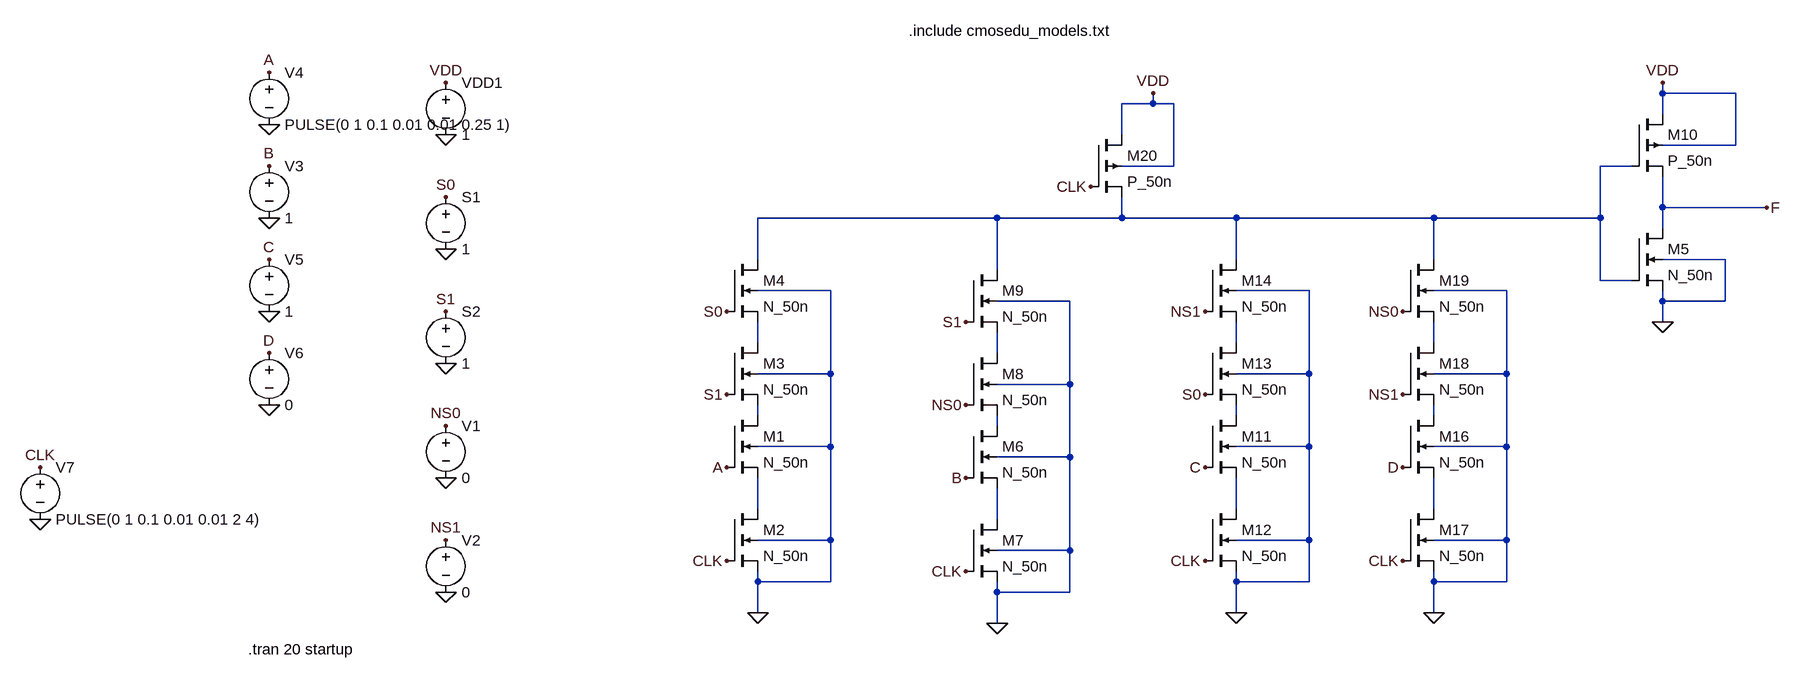
[diagram p0: schematic Draft2.asc]
Draft2.asc, the LTspice schematic file:
Version 4.1
SHEET 1 1412 984
WIRE 1136 112 1136 96
WIRE 1248 112 1136 112
WIRE 352 128 352 112
WIRE 352 128 304 128
WIRE 384 128 352 128
WIRE 1136 144 1136 112
WIRE 304 176 304 128
WIRE 1248 192 1248 112
WIRE 1248 192 1136 192
WIRE 384 224 384 128
WIRE 384 224 304 224
WIRE 1088 224 1040 224
WIRE 1136 288 1136 240
WIRE 1296 288 1136 288
WIRE 112 304 -256 304
WIRE 304 304 304 272
WIRE 304 304 112 304
WIRE 480 304 304 304
WIRE 784 304 480 304
WIRE 1040 304 1040 224
WIRE 1040 304 784 304
WIRE 1136 320 1136 288
WIRE -256 368 -256 304
WIRE 480 368 480 304
WIRE 784 368 784 304
WIRE 1232 368 1136 368
WIRE 112 384 112 304
WIRE 1040 400 1040 304
WIRE 1088 400 1040 400
WIRE -144 416 -256 416
WIRE 592 416 480 416
WIRE 896 416 784 416
WIRE 224 432 112 432
WIRE 1136 432 1136 416
WIRE 1232 432 1232 368
WIRE 1232 432 1136 432
WIRE 1136 464 1136 432
WIRE -256 496 -256 464
WIRE 480 496 480 464
WIRE 784 496 784 464
WIRE 112 512 112 480
WIRE -144 544 -144 416
WIRE -144 544 -256 544
WIRE 592 544 592 416
WIRE 592 544 480 544
WIRE 896 544 896 416
WIRE 896 544 784 544
WIRE 224 560 224 432
WIRE 224 560 112 560
WIRE -256 608 -256 592
WIRE 480 608 480 592
WIRE 784 608 784 592
WIRE 112 624 112 608
WIRE -144 656 -144 544
WIRE -144 656 -256 656
WIRE 592 656 592 544
WIRE 592 656 480 656
WIRE 896 656 896 544
WIRE 896 656 784 656
WIRE 224 672 224 560
WIRE 224 672 112 672
WIRE -256 752 -256 704
WIRE 480 752 480 704
WIRE 784 752 784 704
WIRE 112 768 112 720
WIRE -144 800 -144 656
WIRE -144 800 -256 800
WIRE 592 800 592 656
WIRE 592 800 480 800
WIRE 896 800 896 656
WIRE 896 800 784 800
WIRE 224 816 224 672
WIRE 224 816 112 816
WIRE -256 864 -256 848
WIRE -144 864 -144 800
WIRE -144 864 -256 864
WIRE 480 864 480 848
WIRE 592 864 592 800
WIRE 592 864 480 864
WIRE 784 864 784 848
WIRE 896 864 896 800
WIRE 896 864 784 864
WIRE 112 880 112 864
WIRE 224 880 224 816
WIRE 224 880 112 880
WIRE -256 912 -256 864
WIRE 480 912 480 864
WIRE 784 912 784 864
WIRE 112 928 112 880
FLAG -256 912 0
FLAG 112 928 0
FLAG 480 912 0
FLAG 784 912 0
FLAG 256 256 CLK
FLAG -304 832 CLK
FLAG 64 848 CLK
FLAG 432 832 CLK
FLAG 736 832 CLK
FLAG 352 112 VDD
FLAG -304 448 S0
FLAG -304 576 S1
FLAG -304 688 A
FLAG 64 464 S1
FLAG 64 704 B
FLAG 432 576 S0
FLAG 432 688 C
FLAG 736 688 D
FLAG 64 592 NS0
FLAG 432 448 NS1
FLAG 736 448 NS0
FLAG 736 576 NS1
FLAG 1136 464 0
FLAG 1136 96 VDD
FLAG 1296 288 F
FLAG -736 880 0
FLAG -1008 304 0
FLAG -736 176 0
FLAG -736 352 0
FLAG -736 528 0
FLAG -736 704 0
FLAG -736 96 VDD
FLAG -736 272 S0
FLAG -736 448 S1
FLAG -736 624 NS0
FLAG -736 800 NS1
FLAG -1008 160 0
FLAG -1008 448 0
FLAG -1008 592 0
FLAG -1360 768 0
FLAG -1008 80 A
FLAG -1008 224 B
FLAG -1008 368 C
FLAG -1008 512 D
FLAG -1360 688 CLK
SYMBOL nmos4 -304 608 R0
SYMATTR InstName M1
SYMATTR Value N_50n
SYMBOL nmos4 -304 752 R0
SYMATTR InstName M2
SYMATTR Value N_50n
SYMBOL nmos4 -304 496 R0
SYMATTR InstName M3
SYMATTR Value N_50n
SYMBOL nmos4 -304 368 R0
SYMATTR InstName M4
SYMATTR Value N_50n
SYMBOL nmos4 64 624 R0
SYMATTR InstName M6
SYMATTR Value N_50n
SYMBOL nmos4 64 768 R0
SYMATTR InstName M7
SYMATTR Value N_50n
SYMBOL nmos4 64 512 R0
SYMATTR InstName M8
SYMATTR Value N_50n
SYMBOL nmos4 64 384 R0
SYMATTR InstName M9
SYMATTR Value N_50n
SYMBOL nmos4 432 608 R0
SYMATTR InstName M11
SYMATTR Value N_50n
SYMBOL nmos4 432 752 R0
SYMATTR InstName M12
SYMATTR Value N_50n
SYMBOL nmos4 432 496 R0
SYMATTR InstName M13
SYMATTR Value N_50n
SYMBOL nmos4 432 368 R0
SYMATTR InstName M14
SYMATTR Value N_50n
SYMBOL nmos4 736 608 R0
SYMATTR InstName M16
SYMATTR Value N_50n
SYMBOL nmos4 736 752 R0
SYMATTR InstName M17
SYMATTR Value N_50n
SYMBOL nmos4 736 496 R0
SYMATTR InstName M18
SYMATTR Value N_50n
SYMBOL nmos4 736 368 R0
SYMATTR InstName M19
SYMATTR Value N_50n
SYMBOL pmos4 256 176 R0
SYMATTR InstName M20
SYMATTR Value P_50n
SYMBOL nmos4 1088 320 R0
SYMATTR InstName M5
SYMATTR Value N_50n
SYMBOL pmos4 1088 144 R0
SYMATTR InstName M10
SYMATTR Value P_50n
SYMBOL voltage -736 80 R0
SYMATTR InstName VDD1
SYMATTR Value 1
SYMBOL voltage -736 256 R0
WINDOW 123 0 0 Left 0
WINDOW 39 0 0 Left 0
SYMATTR InstName S1
SYMATTR Value 1
SYMBOL voltage -736 432 R0
SYMATTR InstName S2
SYMATTR Value 1
SYMBOL voltage -736 608 R0
SYMATTR InstName V1
SYMATTR Value 0
SYMBOL voltage -736 784 R0
SYMATTR InstName V2
SYMATTR Value 0
SYMBOL voltage -1008 208 R0
SYMATTR InstName V3
SYMATTR Value 1
SYMBOL voltage -1008 64 R0
SYMATTR InstName V4
SYMATTR Value PULSE(0 1 0.1 0.01 0.01 0.25 1)
SYMBOL voltage -1008 352 R0
SYMATTR InstName V5
SYMATTR Value 1
SYMBOL voltage -1008 496 R0
SYMATTR InstName V6
SYMATTR Value 0
SYMBOL voltage -1360 672 R0
WINDOW 123 0 0 Left 0
WINDOW 39 0 0 Left 0
SYMATTR InstName V7
SYMATTR Value PULSE(0 1 0.1 0.01 0.01 2 4)
TEXT -24 16 Left 2 !.include cmosedu_models.txt
TEXT -1040 968 Left 2 !.tran 20 startup

The netlist it stands for:
* Draft2.asc
M1 N006 A N010 0 N_50n
M2 N010 CLK 0 0 N_50n
M3 N002 S1 N006 0 N_50n
M4 N001 S0 N002 0 N_50n
M6 N009 B N013 0 N_50n
M7 N013 CLK 0 0 N_50n
M8 N005 NS0 N009 0 N_50n
M9 N001 S1 N005 0 N_50n
M11 N007 C N011 0 N_50n
M12 N011 CLK 0 0 N_50n
M13 N003 S0 N007 0 N_50n
M14 N001 NS1 N003 0 N_50n
M16 N008 D N012 0 N_50n
M17 N012 CLK 0 0 N_50n
M18 N004 NS1 N008 0 N_50n
M19 N001 NS0 N004 0 N_50n
M20 VDD CLK N001 VDD P_50n
M5 F N001 0 0 N_50n
M10 VDD N001 F VDD P_50n
VDD1 VDD 0 1
V§S1 S0 0 1
V§S2 S1 0 1
V1 NS0 0 0
V2 NS1 0 0
V3 B 0 1
V4 A 0 PULSE(0 1 0.1 0.01 0.01 0.25 1)
V5 C 0 1
V6 D 0 0
V7 CLK 0 PULSE(0 1 0.1 0.01 0.01 2 4)
.model NMOS NMOS
.model PMOS PMOS
.lib standard.mos
.include cmosedu_models.txt
.tran 20 startup
.backanno
.end